# EAGLE design Proto-Shield_v10 (EAGLE 7.5.0)
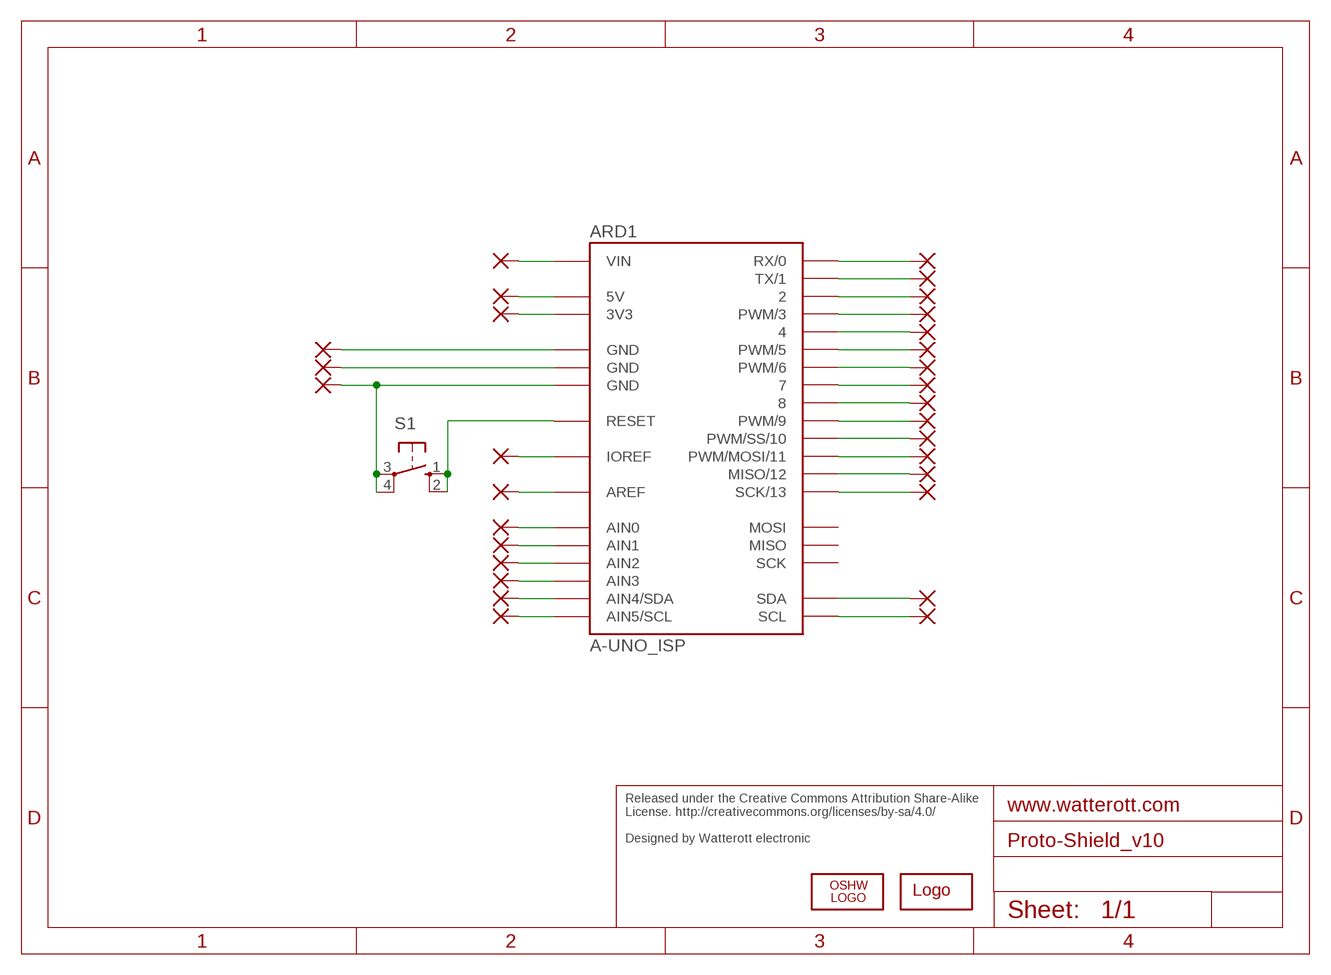
[diagram p0: schematic, sheet 1]

## Parts
ARD1  A-UNO_ISP  [A-UNO-ISP]
LOGO1  OSHW_LOGOX0070  [OSHW_6X70]
LOGO2  LOGO-S_PLACE_S  [SPARK_TPLACE_S]
PAD1  1,6/0,9  [1,6/0,9]
PAD2  1,6/0,9  [1,6/0,9]
PAD3  1,6/0,9  [1,6/0,9]
PAD4  1,6/0,9  [1,6/0,9]
PAD5  1,6/0,9  [1,6/0,9]
PAD6  1,6/0,9  [1,6/0,9]
PAD7  1,6/0,9  [1,6/0,9]
PAD8  1,6/0,9  [1,6/0,9]
PAD9  1,6/0,9  [1,6/0,9]
PAD10  1,6/0,9  [1,6/0,9]
PAD11  1,6/0,9  [1,6/0,9]
PAD12  1,6/0,9  [1,6/0,9]
PAD13  1,6/0,9  [1,6/0,9]
PAD14  1,6/0,9  [1,6/0,9]
PAD15  1,6/0,9  [1,6/0,9]
PAD16  1,6/0,9  [1,6/0,9]
PAD17  1,6/0,9  [1,6/0,9]
PAD18  1,6/0,9  [1,6/0,9]
PAD19  1,6/0,9  [1,6/0,9]
PAD20  1,6/0,9  [1,6/0,9]
PAD21  1,6/0,9  [1,6/0,9]
PAD22  1,6/0,9  [1,6/0,9]
PAD23  1,6/0,9  [1,6/0,9]
PAD24  1,6/0,9  [1,6/0,9]
PAD25  1,6/0,9  [1,6/0,9]
PAD26  1,6/0,9  [1,6/0,9]
PAD27  1,6/0,9  [1,6/0,9]
PAD28  1,6/0,9  [1,6/0,9]
PAD29  1,6/0,9  [1,6/0,9]
PAD30  1,6/0,9  [1,6/0,9]
S1  10-XX  [B3F-10XX]

## Nets
N$43: ARD1.RST(RESET) S1.1(S) S1.2(S1)
N$142: ARD1.IOREF PAD24.1(P)
N$170: ARD1.AREF PAD23.1(P)
N$188: ARD1.A0(AIN0) PAD17.1(P)
N$190: ARD1.A1(AIN1) PAD18.1(P)
N$208: ARD1.A2(AIN2) PAD19.1(P)
N$210: ARD1.A3(AIN3) PAD20.1(P)
N$228: ARD1.A4(AIN4/SDA) PAD21.1(P)
N$230: ARD1.A5(AIN5/SCL) PAD22.1(P)
N$258: ARD1.3V3 PAD28.1(P)
N$278: ARD1.5V PAD29.1(P)
N$279: ARD1.VIN PAD30.1(P)
N$286: ARD1.0(RX/0) PAD1.1(P)
N$287: ARD1.1(TX/1) PAD2.1(P)
N$290: ARD1.2 PAD3.1(P)
N$291: ARD1.3(PWM/3) PAD4.1(P)
N$301: ARD1.4 PAD5.1(P)
N$306: ARD1.5(PWM/5) PAD6.1(P)
N$358: ARD1.6(PWM/6) PAD7.1(P)
N$383: ARD1.7 PAD8.1(P)
N$384: ARD1.8 PAD9.1(P)
N$385: ARD1.9(PWM/9) PAD10.1(P)
N$386: ARD1.10(PWM/SS/10) PAD11.1(P)
N$387: ARD1.11(PWM/MOSI/11) PAD12.1(P)
N$388: ARD1.12(MISO/12) PAD13.1(P)
N$389: ARD1.13(SCK/13) PAD14.1(P)
N$390: ARD1.SDA PAD15.1(P)
N$391: ARD1.SCL PAD16.1(P)
N$747: ARD1.GND@2(GND) PAD26.1(P)
N$748: ARD1.GND@1(GND) PAD27.1(P)
N$750: ARD1.GND@3(GND) PAD25.1(P) S1.3(P) S1.4(P1)
Unconnected: ARD1.MISO ARD1.MOSI ARD1.SCK

## Notes on the sheet
- Released under the Creative Commons Attribution Share-Alike 
  License. http://creativecommons.org/licenses/by-sa/4.0/
  
  Designed by Watterott electronic

## Library data of the parts
ARD1 = we-board:A-UNO_ISP: Arduino Uno
LOGO1 = we-symbol:OSHW_LOGO: Open-Source-Hardware Logo
LOGO2 = we-symbol:LOGO: Watterott electronic Logo
PAD1-PAD30 = wirepad:1,6/0,9: THROUGH-HOLE PAD
S1 = switch-omron:10-XX: OMRON SWITCH; MPN: B3F-1000; OC_FARNELL: 176432; OC_NEWARK: 36M3542

## Board
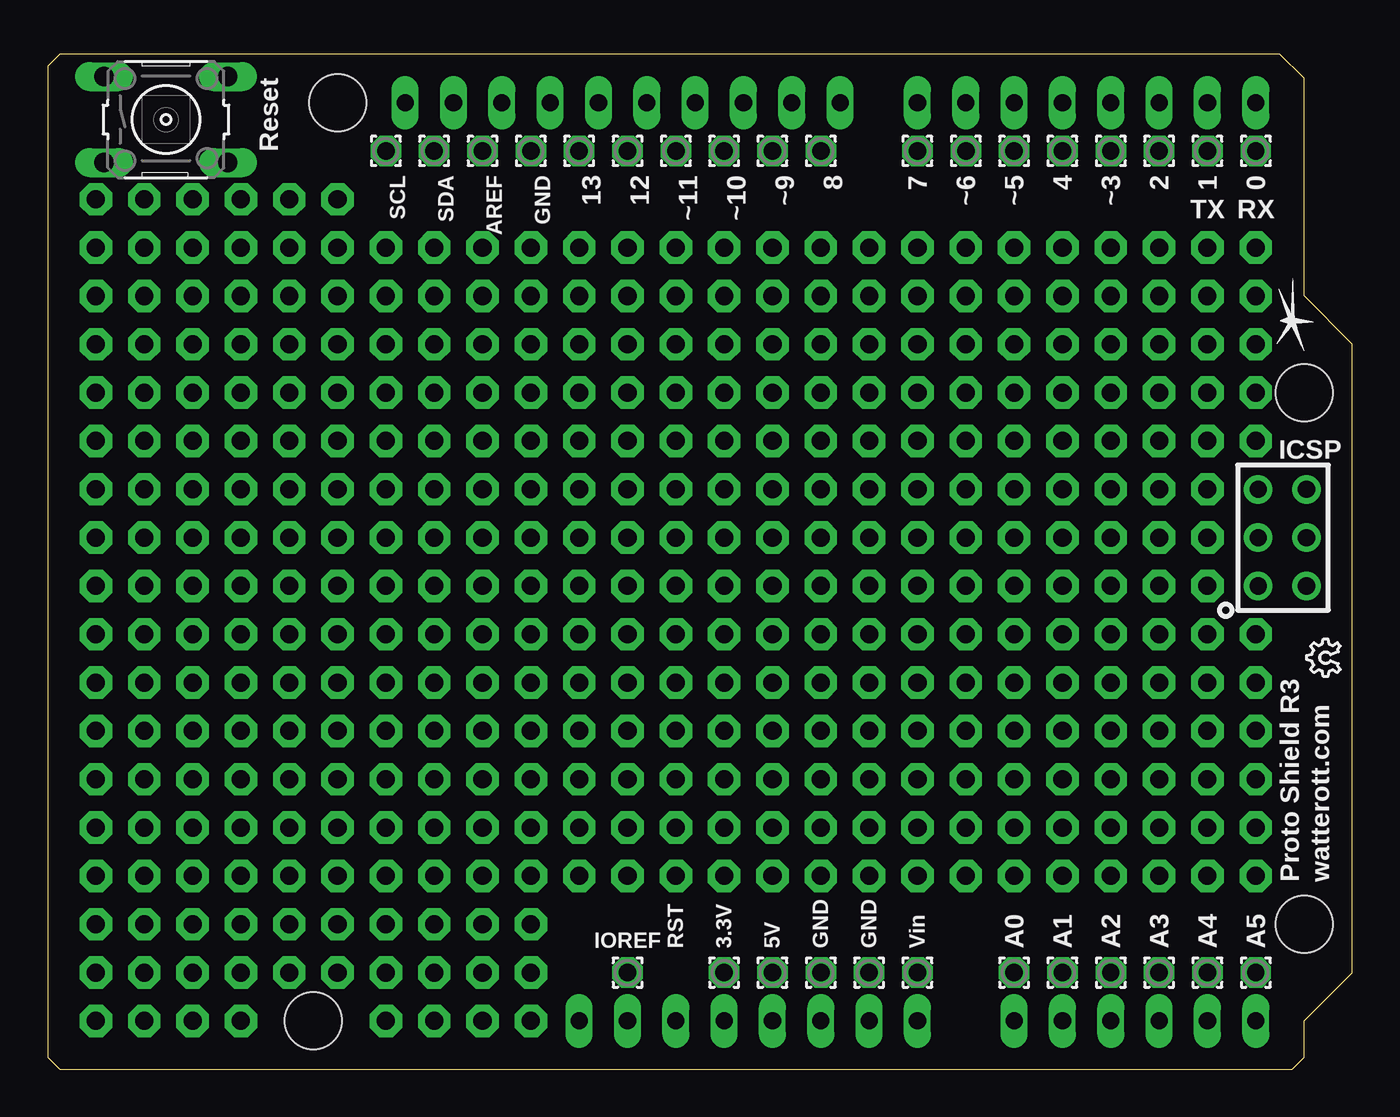
[diagram p1: board, top side]
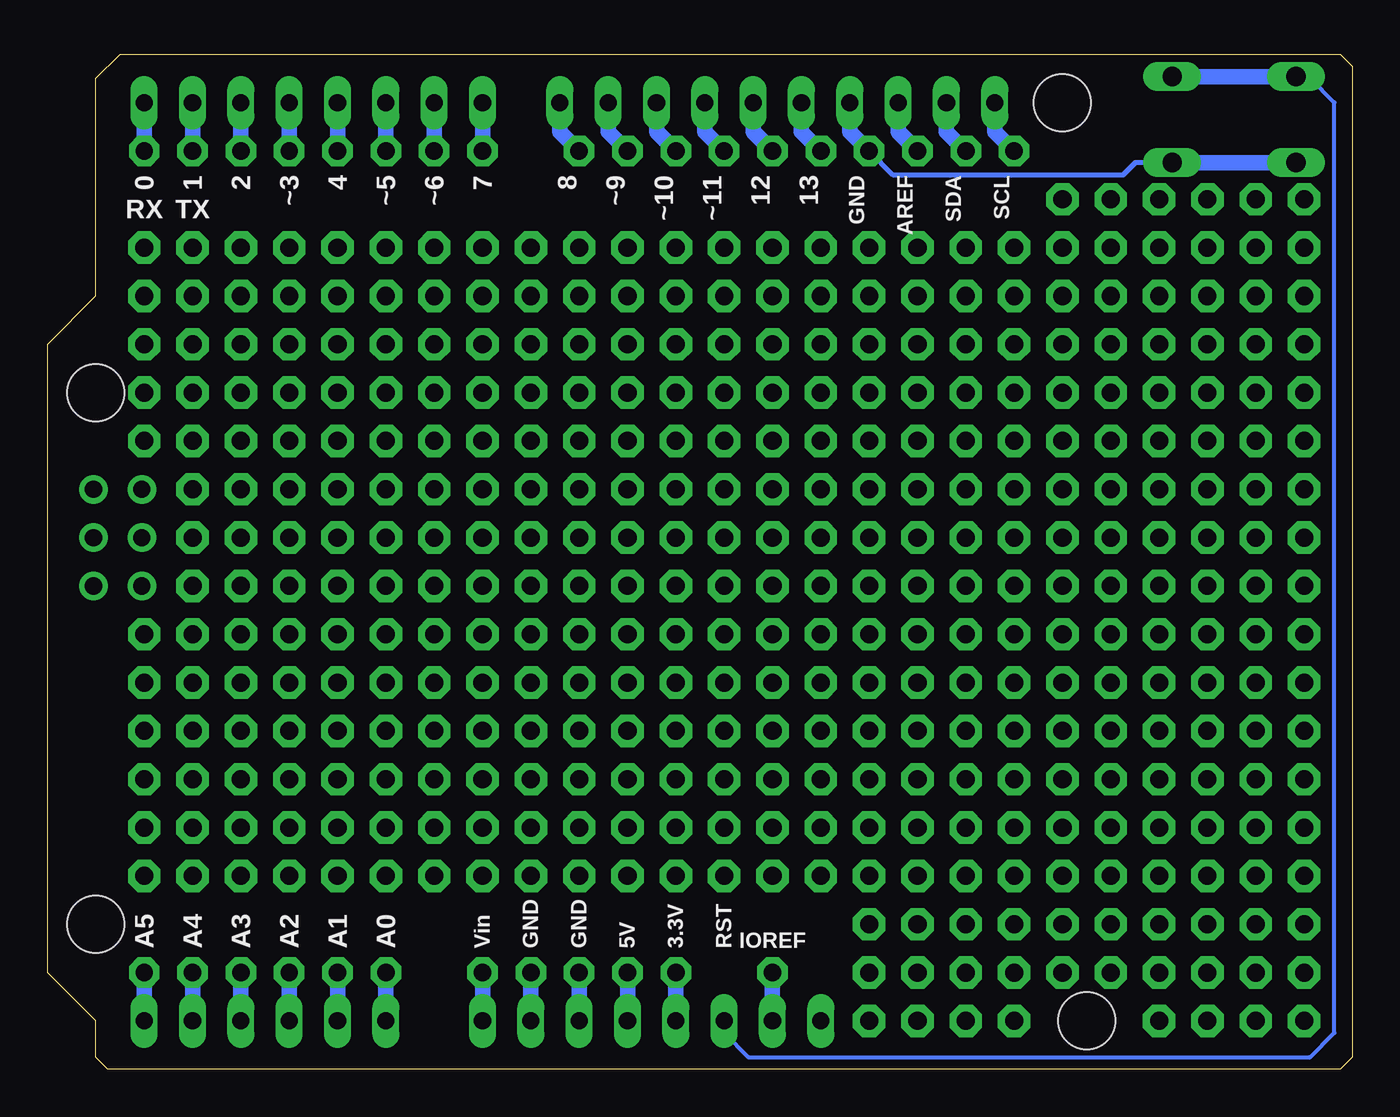
[diagram p2: board, bottom side, seen from below]

Size 68.58 x 53.34 mm. Coordinates in mm from the lower left corner, seen from the top.
Copper layers (1*16): Top 0.035mm / dielectric 1.5mm / Bottom 0.035mm
Design rules "default *": minimum track width 10mil, minimum drill 24mil, track to track 8mil, track to pad 8mil, pad to pad 8mil, via to via 8mil, smd to smd 8mil, copper to edge 10mil, drill to drill 8mil, minimum pad ring 10mil, minimum via ring 8mil, stop-mask expansion 4mil, vias tented up to drill 0mil, thermal gap 10mil

### Footprints (pad centres in the part's own frame; a part is rotated, then mirrored left to right if it is on the bottom)
A-UNO-ISP = drill 0.9 pad 1.2 long: 0 63.5,50.8; 1 60.96,50.8; 2 58.42,50.8; 3 55.88,50.8; 3V3 35.56,2.54; 4 53.34,50.8; 5 50.8,50.8; 5V 38.1,2.54; 6 48.26,50.8; 7 45.72,50.8; 8 41.656,50.8; 9 39.116,50.8; 10 36.576,50.8; 11 34.036,50.8; 12 31.496,50.8; 13 28.956,50.8; A0 50.8,2.54; A1 53.34,2.54; A2 55.88,2.54; A3 58.42,2.54; A4 60.96,2.54; A5 63.5,2.54; AREF 23.876,50.8; GND@1 40.64,2.54; GND@2 43.18,2.54; GND@3 26.416,50.8; IOREF 30.48,2.54; NC 27.94,2.54; RST 33.02,2.54; SCL 18.796,50.8; SDA 21.336,50.8; VIN 45.72,2.54 | drill 0.9 pad 1.5: GND@4 66.167,25.4; MISO 63.627,30.48; MOSI 66.167,27.94; RST2 63.627,25.4; SCK 63.627,27.94; VCC 66.167,30.48 | hole 3: 66.04,35.56; 66.04,7.62; 15.24,50.8; 13.97,2.54
1,6/0,9 = drill 0.914 pad 1.6 octagon: 1 0,0
B3F-10XX = drill 1.016 long: 1 -3.251,2.261; 2 3.251,2.261; 3 -3.251,-2.261; 4 3.251,-2.261

### Placement (x,y rotation side)
ARD1  0,0 0 top
LOGO1  67.94,20.64 90 top
LOGO2  65.41,39.37 90 top
PAD1  63.5,48.26 0 top
PAD2  60.96,48.26 0 top
PAD3  58.42,48.26 0 top
PAD4  55.88,48.26 0 top
PAD5  53.34,48.26 0 top
PAD6  50.8,48.26 0 top
PAD7  48.26,48.26 0 top
PAD8  45.72,48.26 0 top
PAD9  40.64,48.26 0 top
PAD10  38.1,48.26 0 top
PAD11  35.56,48.26 0 top
PAD12  33.02,48.26 0 top
PAD13  30.48,48.26 0 top
PAD14  27.94,48.26 0 top
PAD15  20.32,48.26 0 top
PAD16  17.78,48.26 0 top
PAD17  50.8,5.08 0 top
PAD18  53.34,5.08 0 top
PAD19  55.88,5.08 0 top
PAD20  58.42,5.08 0 top
PAD21  60.96,5.08 0 top
PAD22  63.5,5.08 0 top
PAD23  22.86,48.26 0 top
PAD24  30.48,5.08 0 top
PAD25  25.4,48.26 0 top
PAD26  43.18,5.08 0 top
PAD27  40.64,5.08 0 top
PAD28  35.56,5.08 0 top
PAD29  38.1,5.08 0 top
PAD30  45.72,5.08 0 top
S1  6.22,49.91 0 top

### Tracks (layer width: path | path; a pad name or v marks a point on that pad's centre or on a via)
N$43
  Bottom 0.2: ARD1.RST 33.02,1.91 31.75,0.64 2.22,0.64 0.95,1.91 0.95,50.8 2.22,52.07 2.87,52.07 S1.1
  Bottom 0.813: S1.1 S1.2
N$78  (via drill 0.95 pad 1.7)
  other vias: 63.5,43.18
N$130  (via drill 0.95 pad 1.7)
  other vias: 60.96,43.18
N$132  (via drill 0.95 pad 1.7)
  other vias: 58.42,43.18
N$140  (via drill 0.95 pad 1.7)
  other vias: 55.88,43.18
N$142
  Bottom 0.813: PAD24.1 ARD1.IOREF
N$170
  Bottom 0.813: PAD23.1 23.88,49.28 ARD1.AREF
N$188
  Bottom 0.813: PAD17.1 ARD1.A0
N$190
  Bottom 0.813: PAD18.1 ARD1.A1
N$208
  Bottom 0.813: PAD19.1 ARD1.A2
N$210
  Bottom 0.813: PAD20.1 ARD1.A3
N$228
  Bottom 0.813: PAD21.1 ARD1.A4
N$230
  Bottom 0.813: PAD22.1 ARD1.A5
N$258
  Bottom 0.813: PAD28.1 ARD1.3V3
N$278
  Bottom 0.813: PAD29.1 ARD1.5V
N$279
  Bottom 0.813: PAD30.1 ARD1.VIN
N$286
  Bottom 0.813: ARD1.0 PAD1.1
N$287
  Bottom 0.813: ARD1.1 PAD2.1
N$290
  Bottom 0.813: ARD1.2 PAD3.1
N$291
  Bottom 0.813: ARD1.3 PAD4.1
N$301
  Bottom 0.813: ARD1.4 PAD5.1
N$306
  Bottom 0.813: ARD1.5 PAD6.1
N$358
  Bottom 0.813: ARD1.6 PAD7.1
N$383
  Bottom 0.813: ARD1.7 PAD8.1
N$384
  Bottom 0.813: PAD9.1 41.66,49.28 ARD1.8
N$385
  Bottom 0.813: PAD10.1 39.12,49.28 ARD1.9
N$386
  Bottom 0.813: PAD11.1 36.58,49.28 ARD1.10
N$387
  Bottom 0.813: PAD12.1 34.04,49.28 ARD1.11
N$388
  Bottom 0.813: PAD13.1 31.5,49.28 ARD1.12
N$389
  Bottom 0.813: PAD14.1 28.96,49.28 ARD1.13
N$390
  Bottom 0.813: PAD15.1 21.34,49.28 ARD1.SDA
N$391
  Bottom 0.813: PAD16.1 18.8,49.28 ARD1.SCL
N$392  (via drill 0.95 pad 1.7)
  other vias: 53.34,43.18
N$393  (via drill 0.95 pad 1.7)
  other vias: 50.8,43.18
N$394  (via drill 0.95 pad 1.7)
  other vias: 48.26,43.18
N$395  (via drill 0.95 pad 1.7)
  other vias: 45.72,43.18
N$396  (via drill 0.95 pad 1.7)
  other vias: 43.18,43.18
N$397  (via drill 0.95 pad 1.7)
  other vias: 40.64,43.18
N$398  (via drill 0.95 pad 1.7)
  other vias: 38.1,43.18
N$399  (via drill 0.95 pad 1.7)
  other vias: 35.56,43.18
N$400  (via drill 0.95 pad 1.7)
  other vias: 33.02,43.18
N$401  (via drill 0.95 pad 1.7)
  other vias: 30.48,43.18
N$402  (via drill 0.95 pad 1.7)
  other vias: 27.94,43.18
N$403  (via drill 0.95 pad 1.7)
  other vias: 25.4,43.18
N$404  (via drill 0.95 pad 1.7)
  other vias: 22.86,43.18
N$405  (via drill 0.95 pad 1.7)
  other vias: 20.32,43.18
N$406  (via drill 0.95 pad 1.7)
  other vias: 17.78,43.18
N$407  (via drill 0.95 pad 1.7)
  other vias: 17.78,40.64
N$408  (via drill 0.95 pad 1.7)
  other vias: 20.32,40.64
N$409  (via drill 0.95 pad 1.7)
  other vias: 22.86,40.64
N$410  (via drill 0.95 pad 1.7)
  other vias: 25.4,40.64
N$411  (via drill 0.95 pad 1.7)
  other vias: 27.94,40.64
N$412  (via drill 0.95 pad 1.7)
  other vias: 30.48,40.64
N$413  (via drill 0.95 pad 1.7)
  other vias: 33.02,40.64
N$414  (via drill 0.95 pad 1.7)
  other vias: 35.56,40.64
N$415  (via drill 0.95 pad 1.7)
  other vias: 38.1,40.64
N$416  (via drill 0.95 pad 1.7)
  other vias: 40.64,40.64
N$417  (via drill 0.95 pad 1.7)
  other vias: 43.18,40.64
N$418  (via drill 0.95 pad 1.7)
  other vias: 45.72,40.64
N$419  (via drill 0.95 pad 1.7)
  other vias: 48.26,40.64
N$420  (via drill 0.95 pad 1.7)
  other vias: 50.8,40.64
N$421  (via drill 0.95 pad 1.7)
  other vias: 53.34,40.64
N$422  (via drill 0.95 pad 1.7)
  other vias: 55.88,40.64
N$423  (via drill 0.95 pad 1.7)
  other vias: 58.42,40.64
N$424  (via drill 0.95 pad 1.7)
  other vias: 60.96,40.64
N$425  (via drill 0.95 pad 1.7)
  other vias: 63.5,40.64
N$426  (via drill 0.95 pad 1.7)
  other vias: 63.5,38.1
N$427  (via drill 0.95 pad 1.7)
  other vias: 60.96,38.1
N$428  (via drill 0.95 pad 1.7)
  other vias: 58.42,38.1
N$429  (via drill 0.95 pad 1.7)
  other vias: 55.88,38.1
N$430  (via drill 0.95 pad 1.7)
  other vias: 53.34,38.1
N$431  (via drill 0.95 pad 1.7)
  other vias: 50.8,38.1
N$432  (via drill 0.95 pad 1.7)
  other vias: 48.26,38.1
N$433  (via drill 0.95 pad 1.7)
  other vias: 45.72,38.1
N$434  (via drill 0.95 pad 1.7)
  other vias: 43.18,38.1
N$435  (via drill 0.95 pad 1.7)
  other vias: 40.64,38.1
N$436  (via drill 0.95 pad 1.7)
  other vias: 38.1,38.1
N$437  (via drill 0.95 pad 1.7)
  other vias: 35.56,38.1
N$438  (via drill 0.95 pad 1.7)
  other vias: 33.02,38.1
N$439  (via drill 0.95 pad 1.7)
  other vias: 30.48,38.1
N$440  (via drill 0.95 pad 1.7)
  other vias: 27.94,38.1
N$441  (via drill 0.95 pad 1.7)
  other vias: 25.4,38.1
N$442  (via drill 0.95 pad 1.7)
  other vias: 22.86,38.1
N$443  (via drill 0.95 pad 1.7)
  other vias: 20.32,38.1
N$444  (via drill 0.95 pad 1.7)
  other vias: 17.78,38.1
N$445  (via drill 0.95 pad 1.7)
  other vias: 17.78,35.56
N$446  (via drill 0.95 pad 1.7)
  other vias: 20.32,35.56
N$447  (via drill 0.95 pad 1.7)
  other vias: 22.86,35.56
N$448  (via drill 0.95 pad 1.7)
  other vias: 25.4,35.56
N$449  (via drill 0.95 pad 1.7)
  other vias: 27.94,35.56
N$450  (via drill 0.95 pad 1.7)
  other vias: 30.48,35.56
N$451  (via drill 0.95 pad 1.7)
  other vias: 33.02,35.56
N$452  (via drill 0.95 pad 1.7)
  other vias: 35.56,35.56
N$453  (via drill 0.95 pad 1.7)
  other vias: 38.1,35.56
N$454  (via drill 0.95 pad 1.7)
  other vias: 40.64,35.56
N$455  (via drill 0.95 pad 1.7)
  other vias: 43.18,35.56
N$456  (via drill 0.95 pad 1.7)
  other vias: 45.72,35.56
N$457  (via drill 0.95 pad 1.7)
  other vias: 48.26,35.56
N$458  (via drill 0.95 pad 1.7)
  other vias: 50.8,35.56
N$459  (via drill 0.95 pad 1.7)
  other vias: 53.34,35.56
N$460  (via drill 0.95 pad 1.7)
  other vias: 55.88,35.56
N$461  (via drill 0.95 pad 1.7)
  other vias: 58.42,35.56
N$462  (via drill 0.95 pad 1.7)
  other vias: 60.96,35.56
N$463  (via drill 0.95 pad 1.7)
  other vias: 63.5,35.56
N$464  (via drill 0.95 pad 1.7)
  other vias: 63.5,33.02
N$465  (via drill 0.95 pad 1.7)
  other vias: 60.96,33.02
N$466  (via drill 0.95 pad 1.7)
  other vias: 58.42,33.02
N$467  (via drill 0.95 pad 1.7)
  other vias: 55.88,33.02
N$468  (via drill 0.95 pad 1.7)
  other vias: 53.34,33.02
N$469  (via drill 0.95 pad 1.7)
  other vias: 50.8,33.02
N$470  (via drill 0.95 pad 1.7)
  other vias: 48.26,33.02
N$471  (via drill 0.95 pad 1.7)
  other vias: 45.72,33.02
N$472  (via drill 0.95 pad 1.7)
  other vias: 43.18,33.02
N$473  (via drill 0.95 pad 1.7)
  other vias: 40.64,33.02
N$474  (via drill 0.95 pad 1.7)
  other vias: 38.1,33.02
N$475  (via drill 0.95 pad 1.7)
  other vias: 35.56,33.02
N$476  (via drill 0.95 pad 1.7)
  other vias: 33.02,33.02
N$477  (via drill 0.95 pad 1.7)
  other vias: 30.48,33.02
N$478  (via drill 0.95 pad 1.7)
  other vias: 27.94,33.02
N$479  (via drill 0.95 pad 1.7)
  other vias: 25.4,33.02
N$480  (via drill 0.95 pad 1.7)
  other vias: 22.86,33.02
N$481  (via drill 0.95 pad 1.7)
  other vias: 20.32,33.02
N$482  (via drill 0.95 pad 1.7)
  other vias: 17.78,33.02
N$483  (via drill 0.95 pad 1.7)
  other vias: 17.78,30.48
N$484  (via drill 0.95 pad 1.7)
  other vias: 20.32,30.48
N$485  (via drill 0.95 pad 1.7)
  other vias: 22.86,30.48
N$486  (via drill 0.95 pad 1.7)
  other vias: 25.4,30.48
N$487  (via drill 0.95 pad 1.7)
  other vias: 27.94,30.48
N$488  (via drill 0.95 pad 1.7)
  other vias: 30.48,30.48
N$489  (via drill 0.95 pad 1.7)
  other vias: 33.02,30.48
N$490  (via drill 0.95 pad 1.7)
  other vias: 35.56,30.48
N$491  (via drill 0.95 pad 1.7)
  other vias: 38.1,30.48
N$492  (via drill 0.95 pad 1.7)
  other vias: 40.64,30.48
N$493  (via drill 0.95 pad 1.7)
  other vias: 43.18,30.48
N$494  (via drill 0.95 pad 1.7)
  other vias: 45.72,30.48
N$495  (via drill 0.95 pad 1.7)
  other vias: 48.26,30.48
N$496  (via drill 0.95 pad 1.7)
  other vias: 50.8,30.48
N$497  (via drill 0.95 pad 1.7)
  other vias: 53.34,30.48
N$498  (via drill 0.95 pad 1.7)
  other vias: 55.88,30.48
N$499  (via drill 0.95 pad 1.7)
  other vias: 58.42,30.48
N$500  (via drill 0.95 pad 1.7)
  other vias: 60.96,30.48
N$501  (via drill 0.95 pad 1.7)
  other vias: 60.96,27.94
N$502  (via drill 0.95 pad 1.7)
  other vias: 58.42,27.94
N$503  (via drill 0.95 pad 1.7)
  other vias: 55.88,27.94
N$504  (via drill 0.95 pad 1.7)
  other vias: 53.34,27.94
N$505  (via drill 0.95 pad 1.7)
  other vias: 50.8,27.94
N$506  (via drill 0.95 pad 1.7)
  other vias: 48.26,27.94
N$507  (via drill 0.95 pad 1.7)
  other vias: 45.72,27.94
N$508  (via drill 0.95 pad 1.7)
  other vias: 43.18,27.94
N$509  (via drill 0.95 pad 1.7)
  other vias: 40.64,27.94
N$510  (via drill 0.95 pad 1.7)
  other vias: 38.1,27.94
N$511  (via drill 0.95 pad 1.7)
  other vias: 35.56,27.94
N$512  (via drill 0.95 pad 1.7)
  other vias: 33.02,27.94
N$513  (via drill 0.95 pad 1.7)
  other vias: 30.48,27.94
N$514  (via drill 0.95 pad 1.7)
  other vias: 27.94,27.94
N$515  (via drill 0.95 pad 1.7)
  other vias: 25.4,27.94
N$516  (via drill 0.95 pad 1.7)
  other vias: 22.86,27.94
N$517  (via drill 0.95 pad 1.7)
  other vias: 20.32,27.94
N$518  (via drill 0.95 pad 1.7)
  other vias: 17.78,27.94
N$519  (via drill 0.95 pad 1.7)
  other vias: 17.78,25.4
N$520  (via drill 0.95 pad 1.7)
  other vias: 20.32,25.4
N$521  (via drill 0.95 pad 1.7)
  other vias: 22.86,25.4
N$522  (via drill 0.95 pad 1.7)
  other vias: 25.4,25.4
N$523  (via drill 0.95 pad 1.7)
  other vias: 27.94,25.4
N$524  (via drill 0.95 pad 1.7)
  other vias: 30.48,25.4
N$525  (via drill 0.95 pad 1.7)
  other vias: 33.02,25.4
N$526  (via drill 0.95 pad 1.7)
  other vias: 35.56,25.4
N$527  (via drill 0.95 pad 1.7)
  other vias: 38.1,25.4
N$528  (via drill 0.95 pad 1.7)
  other vias: 40.64,25.4
N$529  (via drill 0.95 pad 1.7)
  other vias: 43.18,25.4
N$530  (via drill 0.95 pad 1.7)
  other vias: 45.72,25.4
N$531  (via drill 0.95 pad 1.7)
  other vias: 48.26,25.4
N$532  (via drill 0.95 pad 1.7)
  other vias: 50.8,25.4
N$533  (via drill 0.95 pad 1.7)
  other vias: 53.34,25.4
N$534  (via drill 0.95 pad 1.7)
  other vias: 55.88,25.4
N$535  (via drill 0.95 pad 1.7)
  other vias: 58.42,25.4
N$536  (via drill 0.95 pad 1.7)
  other vias: 60.96,25.4
N$537  (via drill 0.95 pad 1.7)
  other vias: 60.96,22.86
N$538  (via drill 0.95 pad 1.7)
  other vias: 58.42,22.86
N$539  (via drill 0.95 pad 1.7)
  other vias: 55.88,22.86
N$540  (via drill 0.95 pad 1.7)
  other vias: 53.34,22.86
N$541  (via drill 0.95 pad 1.7)
  other vias: 50.8,22.86
N$542  (via drill 0.95 pad 1.7)
  other vias: 48.26,22.86
N$543  (via drill 0.95 pad 1.7)
  other vias: 45.72,22.86
N$544  (via drill 0.95 pad 1.7)
  other vias: 43.18,22.86
N$545  (via drill 0.95 pad 1.7)
  other vias: 40.64,22.86
N$546  (via drill 0.95 pad 1.7)
  other vias: 38.1,22.86
N$547  (via drill 0.95 pad 1.7)
  other vias: 35.56,22.86
N$548  (via drill 0.95 pad 1.7)
  other vias: 33.02,22.86
N$549  (via drill 0.95 pad 1.7)
  other vias: 30.48,22.86
N$550  (via drill 0.95 pad 1.7)
  other vias: 27.94,22.86
N$551  (via drill 0.95 pad 1.7)
  other vias: 25.4,22.86
N$552  (via drill 0.95 pad 1.7)
  other vias: 22.86,22.86
N$553  (via drill 0.95 pad 1.7)
  other vias: 20.32,22.86
N$554  (via drill 0.95 pad 1.7)
  other vias: 17.78,22.86
N$555  (via drill 0.95 pad 1.7)
  other vias: 17.78,20.32
N$556  (via drill 0.95 pad 1.7)
  other vias: 20.32,20.32
N$557  (via drill 0.95 pad 1.7)
  other vias: 22.86,20.32
N$558  (via drill 0.95 pad 1.7)
  other vias: 25.4,20.32
N$559  (via drill 0.95 pad 1.7)
  other vias: 27.94,20.32
N$560  (via drill 0.95 pad 1.7)
  other vias: 30.48,20.32
N$561  (via drill 0.95 pad 1.7)
  other vias: 33.02,20.32
N$562  (via drill 0.95 pad 1.7)
  other vias: 35.56,20.32
N$563  (via drill 0.95 pad 1.7)
  other vias: 38.1,20.32
N$564  (via drill 0.95 pad 1.7)
  other vias: 40.64,20.32
N$565  (via drill 0.95 pad 1.7)
  other vias: 43.18,20.32
N$566  (via drill 0.95 pad 1.7)
  other vias: 45.72,20.32
N$567  (via drill 0.95 pad 1.7)
  other vias: 48.26,20.32
N$568  (via drill 0.95 pad 1.7)
  other vias: 50.8,20.32
N$569  (via drill 0.95 pad 1.7)
  other vias: 53.34,20.32
N$570  (via drill 0.95 pad 1.7)
  other vias: 55.88,20.32
N$571  (via drill 0.95 pad 1.7)
  other vias: 58.42,20.32
N$572  (via drill 0.95 pad 1.7)
  other vias: 60.96,20.32
N$573  (via drill 0.95 pad 1.7)
  other vias: 63.5,22.86
N$574  (via drill 0.95 pad 1.7)
  other vias: 63.5,20.32
N$575  (via drill 0.95 pad 1.7)
  other vias: 63.5,17.78
N$576  (via drill 0.95 pad 1.7)
  other vias: 63.5,15.24
N$577  (via drill 0.95 pad 1.7)
  other vias: 63.5,12.7
N$578  (via drill 0.95 pad 1.7)
  other vias: 60.96,17.78
N$579  (via drill 0.95 pad 1.7)
  other vias: 58.42,17.78
N$580  (via drill 0.95 pad 1.7)
  other vias: 55.88,17.78
N$581  (via drill 0.95 pad 1.7)
  other vias: 53.34,17.78
N$582  (via drill 0.95 pad 1.7)
  other vias: 50.8,17.78
N$583  (via drill 0.95 pad 1.7)
  other vias: 48.26,17.78
N$584  (via drill 0.95 pad 1.7)
  other vias: 45.72,17.78
N$585  (via drill 0.95 pad 1.7)
  other vias: 43.18,17.78
N$586  (via drill 0.95 pad 1.7)
  other vias: 40.64,17.78
N$587  (via drill 0.95 pad 1.7)
  other vias: 38.1,17.78
N$588  (via drill 0.95 pad 1.7)
  other vias: 35.56,17.78
N$589  (via drill 0.95 pad 1.7)
  other vias: 33.02,17.78
N$590  (via drill 0.95 pad 1.7)
  other vias: 30.48,17.78
N$591  (via drill 0.95 pad 1.7)
  other vias: 27.94,17.78
N$592  (via drill 0.95 pad 1.7)
  other vias: 25.4,17.78
N$593  (via drill 0.95 pad 1.7)
  other vias: 22.86,17.78
N$594  (via drill 0.95 pad 1.7)
  other vias: 20.32,17.78
N$595  (via drill 0.95 pad 1.7)
  other vias: 17.78,17.78
N$596  (via drill 0.95 pad 1.7)
  other vias: 17.78,15.24
N$597  (via drill 0.95 pad 1.7)
  other vias: 20.32,15.24
N$598  (via drill 0.95 pad 1.7)
  other vias: 22.86,15.24
N$599  (via drill 0.95 pad 1.7)
  other vias: 25.4,15.24
N$600  (via drill 0.95 pad 1.7)
  other vias: 27.94,15.24
N$601  (via drill 0.95 pad 1.7)
  other vias: 30.48,15.24
N$602  (via drill 0.95 pad 1.7)
  other vias: 33.02,15.24
N$603  (via drill 0.95 pad 1.7)
  other vias: 35.56,15.24
N$604  (via drill 0.95 pad 1.7)
  other vias: 38.1,15.24
N$605  (via drill 0.95 pad 1.7)
  other vias: 40.64,15.24
N$606  (via drill 0.95 pad 1.7)
  other vias: 43.18,15.24
N$607  (via drill 0.95 pad 1.7)
  other vias: 45.72,15.24
N$608  (via drill 0.95 pad 1.7)
  other vias: 48.26,15.24
N$609  (via drill 0.95 pad 1.7)
  other vias: 50.8,15.24
N$610  (via drill 0.95 pad 1.7)
  other vias: 53.34,15.24
N$611  (via drill 0.95 pad 1.7)
  other vias: 55.88,15.24
N$612  (via drill 0.95 pad 1.7)
  other vias: 58.42,15.24
N$613  (via drill 0.95 pad 1.7)
  other vias: 60.96,15.24
N$614  (via drill 0.95 pad 1.7)
  other vias: 60.96,12.7
N$615  (via drill 0.95 pad 1.7)
  other vias: 58.42,12.7
N$616  (via drill 0.95 pad 1.7)
  other vias: 55.88,12.7
N$617  (via drill 0.95 pad 1.7)
  other vias: 53.34,12.7
N$618  (via drill 0.95 pad 1.7)
  other vias: 50.8,12.7
N$619  (via drill 0.95 pad 1.7)
  other vias: 48.26,12.7
N$620  (via drill 0.95 pad 1.7)
  other vias: 45.72,12.7
N$621  (via drill 0.95 pad 1.7)
  other vias: 43.18,12.7
N$622  (via drill 0.95 pad 1.7)
  other vias: 40.64,12.7
N$623  (via drill 0.95 pad 1.7)
  other vias: 38.1,12.7
N$624  (via drill 0.95 pad 1.7)
  other vias: 35.56,12.7
N$625  (via drill 0.95 pad 1.7)
  other vias: 33.02,12.7
N$626  (via drill 0.95 pad 1.7)
  other vias: 30.48,12.7
N$627  (via drill 0.95 pad 1.7)
  other vias: 27.94,12.7
N$628  (via drill 0.95 pad 1.7)
  other vias: 25.4,12.7
N$629  (via drill 0.95 pad 1.7)
  other vias: 22.86,12.7
N$630  (via drill 0.95 pad 1.7)
  other vias: 20.32,12.7
N$631  (via drill 0.95 pad 1.7)
  other vias: 17.78,12.7
N$632  (via drill 0.95 pad 1.7)
  other vias: 17.78,10.16
N$633  (via drill 0.95 pad 1.7)
  other vias: 20.32,10.16
N$634  (via drill 0.95 pad 1.7)
  other vias: 22.86,10.16
N$635  (via drill 0.95 pad 1.7)
  other vias: 25.4,10.16
N$636  (via drill 0.95 pad 1.7)
  other vias: 27.94,10.16
N$637  (via drill 0.95 pad 1.7)
  other vias: 30.48,10.16
N$638  (via drill 0.95 pad 1.7)
  other vias: 33.02,10.16
N$639  (via drill 0.95 pad 1.7)
  other vias: 35.56,10.16
N$640  (via drill 0.95 pad 1.7)
  other vias: 38.1,10.16
N$641  (via drill 0.95 pad 1.7)
  other vias: 40.64,10.16
N$642  (via drill 0.95 pad 1.7)
  other vias: 43.18,10.16
N$643  (via drill 0.95 pad 1.7)
  other vias: 45.72,10.16
N$644  (via drill 0.95 pad 1.7)
  other vias: 48.26,10.16
N$645  (via drill 0.95 pad 1.7)
  other vias: 50.8,10.16
N$646  (via drill 0.95 pad 1.7)
  other vias: 53.34,10.16
N$647  (via drill 0.95 pad 1.7)
  other vias: 55.88,10.16
N$648  (via drill 0.95 pad 1.7)
  other vias: 58.42,10.16
N$649  (via drill 0.95 pad 1.7)
  other vias: 60.96,10.16
N$650  (via drill 0.95 pad 1.7)
  other vias: 15.24,43.18
N$651  (via drill 0.95 pad 1.7)
  other vias: 12.7,43.18
N$652  (via drill 0.95 pad 1.7)
  other vias: 10.16,43.18
N$653  (via drill 0.95 pad 1.7)
  other vias: 7.62,43.18
N$654  (via drill 0.95 pad 1.7)
  other vias: 5.08,43.18
N$655  (via drill 0.95 pad 1.7)
  other vias: 2.54,43.18
N$656  (via drill 0.95 pad 1.7)
  other vias: 2.54,40.64
N$657  (via drill 0.95 pad 1.7)
  other vias: 5.08,40.64
N$658  (via drill 0.95 pad 1.7)
  other vias: 7.62,40.64
N$659  (via drill 0.95 pad 1.7)
  other vias: 10.16,40.64
N$660  (via drill 0.95 pad 1.7)
  other vias: 12.7,40.64
N$661  (via drill 0.95 pad 1.7)
  other vias: 15.24,40.64
N$662  (via drill 0.95 pad 1.7)
  other vias: 15.24,38.1
N$663  (via drill 0.95 pad 1.7)
  other vias: 12.7,38.1
N$664  (via drill 0.95 pad 1.7)
  other vias: 10.16,38.1
N$665  (via drill 0.95 pad 1.7)
  other vias: 7.62,38.1
N$666  (via drill 0.95 pad 1.7)
  other vias: 5.08,38.1
N$667  (via drill 0.95 pad 1.7)
  other vias: 2.54,38.1
N$668  (via drill 0.95 pad 1.7)
  other vias: 2.54,35.56
N$669  (via drill 0.95 pad 1.7)
  other vias: 5.08,35.56
N$670  (via drill 0.95 pad 1.7)
  other vias: 7.62,35.56
N$671  (via drill 0.95 pad 1.7)
  other vias: 10.16,35.56
N$672  (via drill 0.95 pad 1.7)
  other vias: 12.7,35.56
N$673  (via drill 0.95 pad 1.7)
  other vias: 15.24,35.56
N$674  (via drill 0.95 pad 1.7)
  other vias: 15.24,33.02
N$675  (via drill 0.95 pad 1.7)
  other vias: 12.7,33.02
N$676  (via drill 0.95 pad 1.7)
  other vias: 10.16,33.02
N$677  (via drill 0.95 pad 1.7)
  other vias: 7.62,33.02
N$678  (via drill 0.95 pad 1.7)
  other vias: 5.08,33.02
N$679  (via drill 0.95 pad 1.7)
  other vias: 2.54,33.02
N$680  (via drill 0.95 pad 1.7)
  other vias: 2.54,30.48
N$681  (via drill 0.95 pad 1.7)
  other vias: 5.08,30.48
N$682  (via drill 0.95 pad 1.7)
  other vias: 7.62,30.48
N$683  (via drill 0.95 pad 1.7)
  other vias: 10.16,30.48
N$684  (via drill 0.95 pad 1.7)
  other vias: 12.7,30.48
N$685  (via drill 0.95 pad 1.7)
  other vias: 15.24,30.48
N$686  (via drill 0.95 pad 1.7)
  other vias: 15.24,27.94
N$687  (via drill 0.95 pad 1.7)
  other vias: 12.7,27.94
N$688  (via drill 0.95 pad 1.7)
  other vias: 10.16,27.94
N$689  (via drill 0.95 pad 1.7)
  other vias: 7.62,27.94
N$690  (via drill 0.95 pad 1.7)
  other vias: 5.08,27.94
N$691  (via drill 0.95 pad 1.7)
  other vias: 2.54,27.94
N$692  (via drill 0.95 pad 1.7)
  other vias: 2.54,25.4
N$693  (via drill 0.95 pad 1.7)
  other vias: 5.08,25.4
N$694  (via drill 0.95 pad 1.7)
  other vias: 7.62,25.4
N$695  (via drill 0.95 pad 1.7)
  other vias: 10.16,25.4
N$696  (via drill 0.95 pad 1.7)
  other vias: 12.7,25.4
N$697  (via drill 0.95 pad 1.7)
  other vias: 15.24,25.4
N$698  (via drill 0.95 pad 1.7)
  other vias: 15.24,22.86
N$699  (via drill 0.95 pad 1.7)
  other vias: 12.7,22.86
N$700  (via drill 0.95 pad 1.7)
  other vias: 10.16,22.86
N$701  (via drill 0.95 pad 1.7)
  other vias: 7.62,22.86
N$702  (via drill 0.95 pad 1.7)
  other vias: 5.08,22.86
N$703  (via drill 0.95 pad 1.7)
  other vias: 2.54,22.86
N$704  (via drill 0.95 pad 1.7)
  other vias: 2.54,20.32
N$705  (via drill 0.95 pad 1.7)
  other vias: 5.08,20.32
N$706  (via drill 0.95 pad 1.7)
  other vias: 7.62,20.32
N$707  (via drill 0.95 pad 1.7)
  other vias: 10.16,20.32
N$708  (via drill 0.95 pad 1.7)
  other vias: 12.7,20.32
N$709  (via drill 0.95 pad 1.7)
  other vias: 15.24,20.32
N$710  (via drill 0.95 pad 1.7)
  other vias: 15.24,17.78
N$711  (via drill 0.95 pad 1.7)
  other vias: 12.7,17.78
N$712  (via drill 0.95 pad 1.7)
  other vias: 10.16,17.78
N$713  (via drill 0.95 pad 1.7)
  other vias: 7.62,17.78
N$714  (via drill 0.95 pad 1.7)
  other vias: 5.08,17.78
N$715  (via drill 0.95 pad 1.7)
  other vias: 2.54,17.78
N$716  (via drill 0.95 pad 1.7)
  other vias: 2.54,15.24
N$717  (via drill 0.95 pad 1.7)
  other vias: 5.08,15.24
N$718  (via drill 0.95 pad 1.7)
  other vias: 7.62,15.24
N$719  (via drill 0.95 pad 1.7)
  other vias: 10.16,15.24
N$720  (via drill 0.95 pad 1.7)
  other vias: 12.7,15.24
N$721  (via drill 0.95 pad 1.7)
  other vias: 15.24,15.24
N$722  (via drill 0.95 pad 1.7)
  other vias: 15.24,12.7
N$723  (via drill 0.95 pad 1.7)
  other vias: 15.24,10.16
N$724  (via drill 0.95 pad 1.7)
  other vias: 12.7,10.16
N$725  (via drill 0.95 pad 1.7)
  other vias: 12.7,12.7
N$726  (via drill 0.95 pad 1.7)
  other vias: 10.16,12.7
N$727  (via drill 0.95 pad 1.7)
  other vias: 10.16,10.16
N$728  (via drill 0.95 pad 1.7)
  other vias: 7.62,10.16
N$729  (via drill 0.95 pad 1.7)
  other vias: 7.62,12.7
N$730  (via drill 0.95 pad 1.7)
  other vias: 5.08,12.7
N$731  (via drill 0.95 pad 1.7)
  other vias: 5.08,10.16
N$732  (via drill 0.95 pad 1.7)
  other vias: 2.54,10.16
N$733  (via drill 0.95 pad 1.7)
  other vias: 2.54,12.7
N$734  (via drill 0.95 pad 1.7)
  other vias: 12.7,45.72
N$735  (via drill 0.95 pad 1.7)
  other vias: 15.24,45.72
N$736  (via drill 0.95 pad 1.7)
  other vias: 25.4,7.62
N$737  (via drill 0.95 pad 1.7)
  other vias: 22.86,7.62
N$738  (via drill 0.95 pad 1.7)
  other vias: 20.32,7.62
N$739  (via drill 0.95 pad 1.7)
  other vias: 17.78,7.62
N$740  (via drill 0.95 pad 1.7)
  other vias: 15.24,7.62
N$741  (via drill 0.95 pad 1.7)
  other vias: 12.7,7.62
N$742  (via drill 0.95 pad 1.7)
  other vias: 10.16,7.62
N$743  (via drill 0.95 pad 1.7)
  other vias: 7.62,7.62
N$745  (via drill 0.95 pad 1.7)
  other vias: 5.08,7.62
N$746  (via drill 0.95 pad 1.7)
  other vias: 2.54,5.08
N$747
  Bottom 0.813: ARD1.GND@2 PAD26.1
N$748
  Bottom 0.813: PAD27.1 ARD1.GND@1
N$749  (via drill 0.95 pad 1.7)
  other vias: 2.54,7.62
N$750
  Bottom 0.254: S1.4 11.4,47.65 12.06,46.99 24.13,46.99 PAD25.1
  Bottom 0.813: S1.3 S1.4 | ARD1.GND@3 26.42,49.28 PAD25.1
N$751  (via drill 0.95 pad 1.7)
  other vias: 5.08,5.08
N$752  (via drill 0.95 pad 1.7)
  other vias: 7.62,5.08
N$753  (via drill 0.95 pad 1.7)
  other vias: 10.16,5.08
N$754  (via drill 0.95 pad 1.7)
  other vias: 2.54,2.54
N$755  (via drill 0.95 pad 1.7)
  other vias: 5.08,2.54
N$756  (via drill 0.95 pad 1.7)
  other vias: 7.62,2.54
N$757  (via drill 0.95 pad 1.7)
  other vias: 10.16,2.54
N$758  (via drill 0.95 pad 1.7)
  other vias: 17.78,5.08
N$759  (via drill 0.95 pad 1.7)
  other vias: 17.78,2.54
N$760  (via drill 0.95 pad 1.7)
  other vias: 20.32,2.54
N$761  (via drill 0.95 pad 1.7)
  other vias: 20.32,5.08
N$762  (via drill 0.95 pad 1.7)
  other vias: 22.86,5.08
N$763  (via drill 0.95 pad 1.7)
  other vias: 22.86,2.54
N$764  (via drill 0.95 pad 1.7)
  other vias: 25.4,5.08
N$765  (via drill 0.95 pad 1.7)
  other vias: 25.4,2.54
N$773  (via drill 0.95 pad 1.7)
  other vias: 63.5,10.16
N$775  (via drill 0.95 pad 1.7)
  other vias: 10.16,45.72
N$776  (via drill 0.95 pad 1.7)
  other vias: 7.62,45.72
N$777  (via drill 0.95 pad 1.7)
  other vias: 5.08,45.72
N$778  (via drill 0.95 pad 1.7)
  other vias: 2.54,45.72
N$779  (via drill 0.95 pad 1.7)
  other vias: 12.7,5.08
N$780  (via drill 0.95 pad 1.7)
  other vias: 15.24,5.08

### Text on the board
tPlace: Reset | SCL | SDA | AREF | GND | 13 | 12 | ~11 | ~10 | ~9 | 8 | 7 | ~6 | ~5 | 4 | ~3 | 2 | 1 | 0 | TX | RX | ICSP | Proto Shield R3 | watterott.com | IOREF | RST | 3.3V | 5V | GND | GND | Vin | A0 | A1 | A2 | A3 | A4 | A5
bPlace: SCL | SDA | AREF | GND | 13 | 12 | ~11 | ~10 | ~9 | 8 | 7 | ~6 | ~5 | 4 | ~3 | 2 | 1 | 0 | TX | RX | IOREF | RST | 3.3V | 5V | GND | GND | Vin | A0 | A1 | A2 | A3 | A4 | A5
Reference: Silkscreen: 21 tPlace + 22 bPlace